# Altium schematic sheet CONNECTOR.SchDoc
size A4
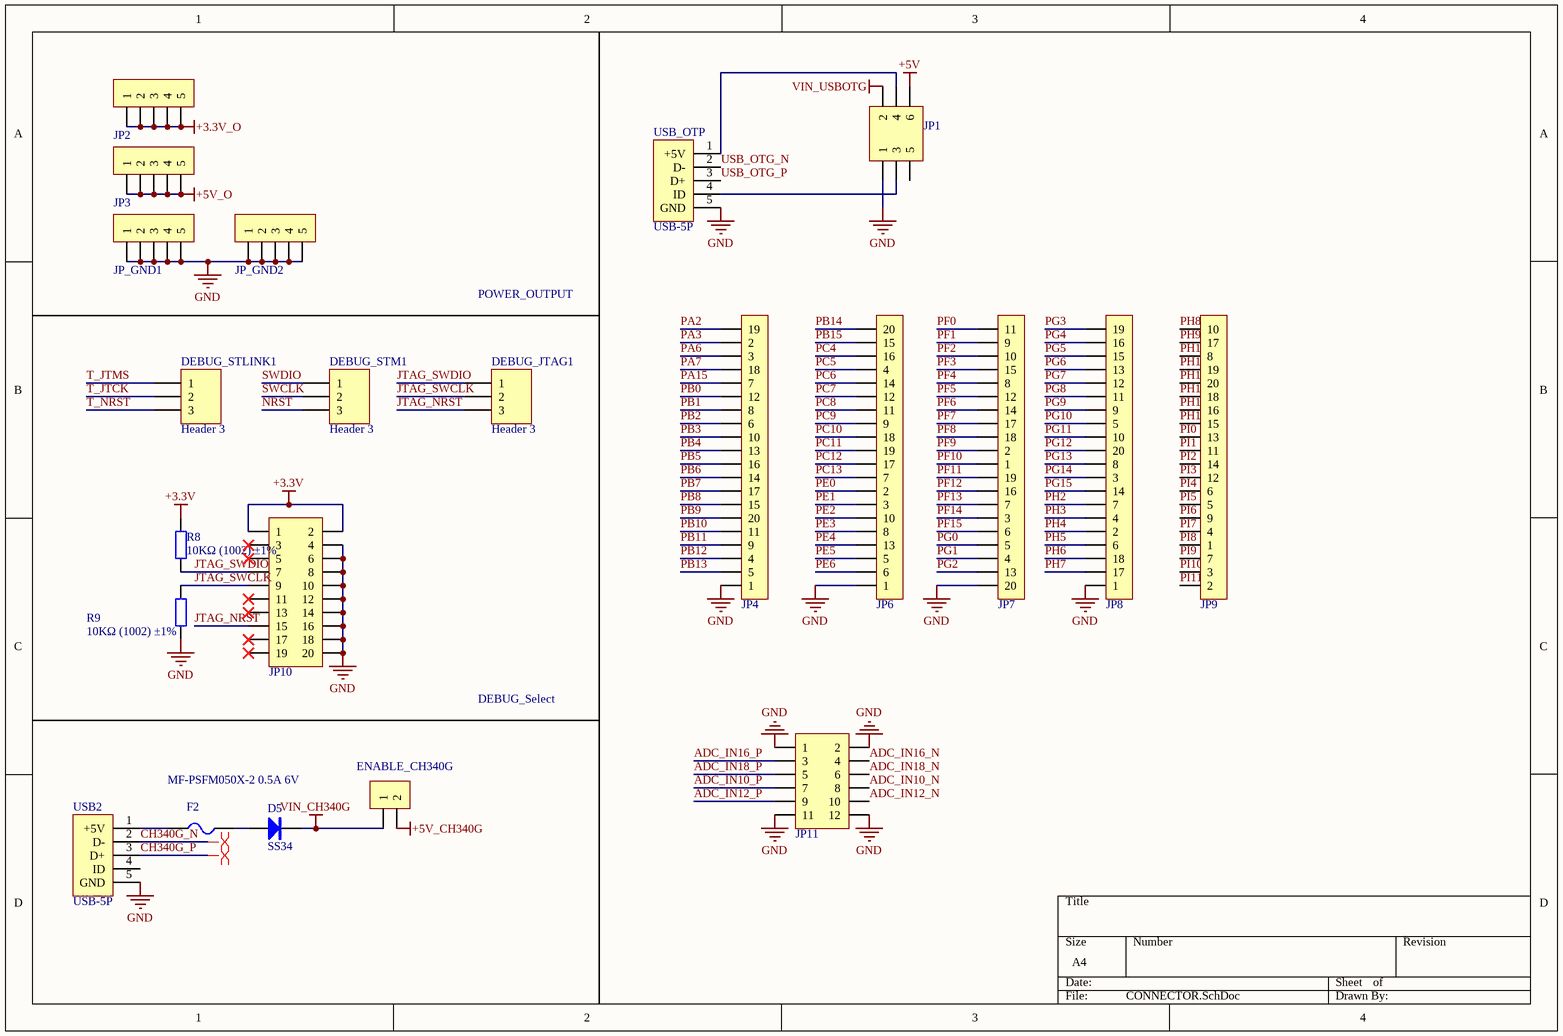
[diagram p0: CONNECTOR.SchDoc]

## Parts
D5  SS34  [SMC]
DEBUG_JTAG1  Header 3  [HDR1X3]
DEBUG_STLINK1  Header 3  [HDR1X3]
DEBUG_STM1  Header 3  [HDR1X3]
ENABLE_CH340G  HDR-1X2  [HDR2.54-LI-2P]  (value not drawn)
F2  MF-PSFM050X-2 0.5A 6V  [FU 0805]
JP1  Header3X2  [HDR2.54-LI-2x3P]  (value not drawn)
JP2  HDR-1X5  [HDR2.54-LI-5P]  (value not drawn)
JP3  HDR-1X5  [HDR2.54-LI-5P]  (value not drawn)
JP4  HDR-1X20  [HDR2.54-LI-20P]  (value not drawn)
JP6  HDR-1X20  [HDR2.54-LI-20P]  (value not drawn)
JP7  HDR-1X20  [HDR2.54-LI-20P]  (value not drawn)
JP8  HDR-1X20  [HDR2.54-LI-20P]  (value not drawn)
JP9  HDR-1X20  [HDR2.54-LI-20P]  (value not drawn)
JP10  Header 2X10  [IDC2.54-LI-2x10P]  (value not drawn)
JP11  Header 6X2  [HDR2.54-LI-2x6P]  (value not drawn)
JP_GND1  HDR-1X5  [HDR2.54-LI-5P]  (value not drawn)
JP_GND2  HDR-1X5  [HDR2.54-LI-5P]  (value not drawn)
R8  10KΩ (1002) ±1%  [0603_R]
R9  10KΩ (1002) ±1%  [0603_R]
USB2  USB-5P  [USB-MICRO_D]
USB_OTP  USB-5P  [USB-MICRO_D]

## Nets
+3.3V: JP10.1 JP10.2 R8.2
+3.3V_O: JP2.1 JP2.2 JP2.3 JP2.4 JP2.5
+5V: JP1.6
+5V_CH340G: ENABLE_CH340G.2
+5V_O: JP3.1 JP3.2 JP3.3 JP3.4 JP3.5
GND: JP1.1 JP4.1 JP6.1 JP7.20 JP8.1 JP10.4 JP10.6 JP10.8 JP10.10 JP10.12 JP10.14 JP10.16 JP10.18 JP10.20 JP11.1 JP11.2 JP11.11 JP11.12 JP_GND1.1 JP_GND1.2 JP_GND1.3 JP_GND1.4 JP_GND1.5 JP_GND2.1 JP_GND2.2 JP_GND2.3 JP_GND2.4 JP_GND2.5 R9.1 USB2.5(GND) USB_OTP.5(GND)
VIN_CH340G: D5.2(K) ENABLE_CH340G.1
VIN_USBOTG: JP1.2
ADC_IN10_N: JP11.8
ADC_IN10_P: JP11.7
ADC_IN12_N: JP11.10
ADC_IN12_P: JP11.9
ADC_IN16_N: JP11.4
ADC_IN16_P: JP11.3
ADC_IN18_N: JP11.6
ADC_IN18_P: JP11.5
CH340G_N: USB2.2(D-)
CH340G_P: USB2.3(D+)
JTAG_NRST: DEBUG_JTAG1.3 JP10.15
JTAG_SWCLK: DEBUG_JTAG1.2 JP10.9 R9.2
JTAG_SWDIO: DEBUG_JTAG1.1 JP10.7 R8.1
NRST: DEBUG_STM1.3
PA2: JP4.19
PA3: JP4.2
PA6: JP4.3
PA7: JP4.18
PA15: JP4.7
PB0: JP4.12
PB1: JP4.8
PB2: JP4.6
PB3: JP4.10
PB4: JP4.13
PB5: JP4.16
PB6: JP4.14
PB7: JP4.17
PB8: JP4.15
PB9: JP4.20
PB10: JP4.11
PB11: JP4.9
PB12: JP4.4
PB13: JP4.5
PB14: JP6.20
PB15: JP6.15
PC4: JP6.16
PC5: JP6.4
PC6: JP6.14
PC7: JP6.12
PC8: JP6.11
PC9: JP6.9
PC10: JP6.18
PC11: JP6.19
PC12: JP6.17
PC13: JP6.7
PE0: JP6.2
PE1: JP6.3
PE2: JP6.10
PE3: JP6.8
PE4: JP6.13
PE5: JP6.5
PE6: JP6.6
PF0: JP7.11
PF1: JP7.9
PF2: JP7.10
PF3: JP7.15
PF4: JP7.8
PF5: JP7.12
PF6: JP7.14
PF7: JP7.17
PF8: JP7.18
PF9: JP7.2
PF10: JP7.1
PF11: JP7.19
PF12: JP7.16
PF13: JP7.7
PF14: JP7.3
PF15: JP7.6
PG0: JP7.5
PG1: JP7.4
PG2: JP7.13
PG3: JP8.19
PG4: JP8.16
PG5: JP8.15
PG6: JP8.13
PG7: JP8.12
PG8: JP8.11
PG9: JP8.9
PG10: JP8.5
PG11: JP8.10
PG12: JP8.20
PG13: JP8.8
PG14: JP8.3
PG15: JP8.14
PH2: JP8.7
PH3: JP8.4
PH4: JP8.2
PH5: JP8.6
PH6: JP8.18
PH7: JP8.17
PH8: JP9.10
PH9: JP9.17
PH10: JP9.8
PH11: JP9.19
PH12: JP9.20
PH13: JP9.18
PH14: JP9.16
PH15: JP9.15
PI0: JP9.13
PI1: JP9.11
PI2: JP9.14
PI3: JP9.12
PI4: JP9.6
PI5: JP9.5
PI6: JP9.9
PI7: JP9.4
PI8: JP9.1
PI9: JP9.7
PI10: JP9.3
PI11: JP9.2
SWCLK: DEBUG_STM1.2
SWDIO: DEBUG_STM1.1
T_JTCK: DEBUG_STLINK1.2
T_JTMS: DEBUG_STLINK1.1
T_NRST: DEBUG_STLINK1.3
USB_OTG_N: USB_OTP.2(D-)
USB_OTG_P: USB_OTP.3(D+)
NetD5_1: D5.1(A) F2.2
NetF2_1: F2.1 USB2.1(+5V)
NetJP1_3: JP1.3 USB_OTP.4(ID)
NetJP1_4: JP1.4 USB_OTP.1(+5V)

Not connected (* = marked no-connect by the designer): JP1 5; JP10 3* 5* 11* 13* 17* 19*; USB2 4(ID)

## Layout directives
differential pair: CH340G_N, CH340G_P

## Notes on the sheet
- POWER_OUTPUT
- DEBUG_Select

## Library data of the parts
D5 = SS34: 肖特基二极管; 版权归属: 源创客; 属性: 40V/3A; BOM名称: 肖特基二极管; 学习资源: www.ooocke.com
DEBUG_JTAG1 DEBUG_STLINK1 DEBUG_STM1 = Header 3: Header, 3-Pin; LatestRevisionDate: 17-Jul-2002; LatestRevisionNote: Re-released for DXP Platform.; Publisher: Altium Limited
ENABLE_CH340G = Header 2: 2P接插件; 版权归属: 源创客; BOM名称: 2P接插件; 学习资源: www.ooocke.com
F2 = FU: 贴片保险丝; 版权归属: 源创客; BOM名称: 贴片保险丝; 学习资源: www.ooocke.com
JP1 = Header 3X2: 3*2P接插件; 版权归属: 源创客; BOM名称: 3*2P接插件; 学习资源: www.ooocke.com
JP2 JP3 JP_GND1 JP_GND2 = Header 5: 5P接插件; 版权归属: 源创客; BOM名称: 5P接插件; 学习资源: www.ooocke.com
JP4 JP6-JP9 = Header 20: 20P接插件; 版权归属: 源创客; BOM名称: 20P接插件; 学习资源: www.ooocke.com
JP10 = Header 10X2: 10*2P接插件; 版权归属: 源创客; BOM名称: 10*2P接插件; 学习资源: www.ooocke.com
JP11 = Header  6X2: 6*2P接插件; 版权归属: 源创客; BOM名称: 6*2P接插件; 学习资源: www.ooocke.com
R8 R9 = 0603 10KΩ (1002) 1%: 贴片电阻; ComponentLink1Description: 供应商链接; ComponentLink1URL: http://www.szlcsc.com/product/details_26547.html; Package: 0603; Supplier: LC; SuppliersPartNumber: C25804
USB2 USB_OTP = USB-5P: 微型USB母座; 版权归属: 源创客; BOM名称: 微型USB母座; 学习资源: www.ooocke.com